# EAGLE design SisCity (EAGLE 7.7.0)
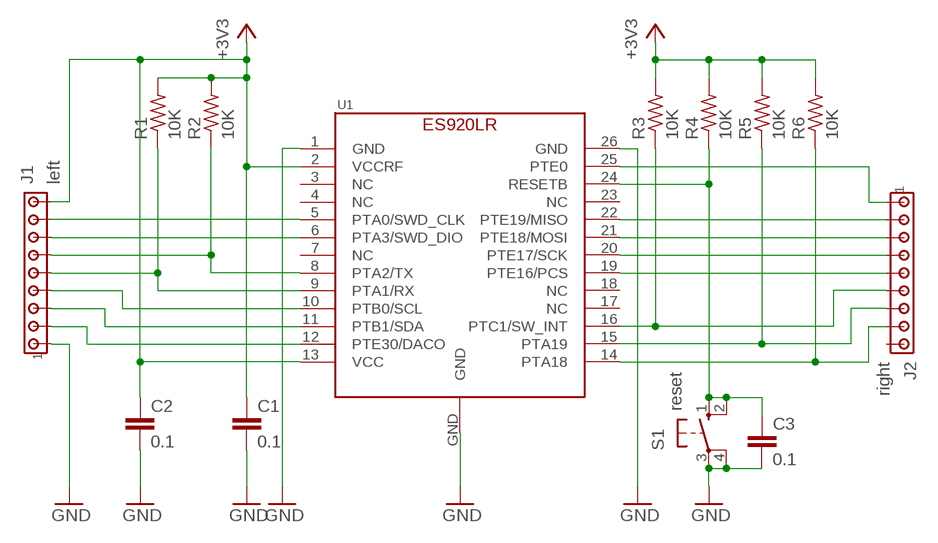
[diagram p0: schematic, sheet 1]

## Parts
C1  0.1  C  [C0805]
C2  0.1  C  [C0805]
C3  0.1  C  [C0805]
J1  left  MTA09-100  [10X09MTA]
J2  right  MTA09-100  [10X09MTA]
R1  10K  R-US_M0805  [M0805]
R2  10K  R-US_M0805  [M0805]
R3  10K  R-US_M0805  [M0805]
R4  10K  R-US_M0805  [M0805]
R5  10K  R-US_M0805  [M0805]
R6  10K  R-US_M0805  [M0805]
S1  reset  SW_10-XX  [B3F-10XX]
U1  ES920LR  [ES920LR]

## Nets
+3V3 [3V3]: C1.1 C2.1 J1.9 R1.2 R2.2 R3.2 R4.2 R5.2 R6.2 U1.2(VCCRF) U1.13(VCC)
GND [GND]: C1.2 C2.2 C3.2 J1.1 S1.3(P) S1.4(P1) U1.1(GND) U1.26(GND) U1.GND
N$1: J1.8 U1.5(PTA0/SWD_CLK)
N$2: J1.7 U1.6(PTA3/SWD_DIO)
N$3: J1.4 U1.10(PTB0/SCL)
N$4: J1.6 R2.1 U1.8(PTA2/TX)
N$5: J1.5 R1.1 U1.9(PTA1/RX)
N$6: J1.3 U1.11(PTB1/SDA)
N$7: J1.2 U1.12(PTE30/DACO)
N$8: J2.1 U1.25(PTE0)
N$9: J2.2 U1.22(PTE19/MISO)
N$10: J2.3 U1.21(PTE18/MOSI)
N$11: J2.4 U1.20(PTE17/SCK)
N$12: J2.5 U1.19(PTE16/PCS)
N$13: J2.8 R6.1 U1.14(PTA18)
N$14: J2.7 R5.1 U1.15(PTA19)
N$15: J2.6 R3.1 U1.16(PTC1/SW_INT)
N$17: C3.1 R4.1 S1.1(S) S1.2(S1) U1.24(RESETB)
Unconnected: J2.9 U1.3(NC) U1.4(NC) U1.7(NC) U1.17(NC) U1.18(NC) U1.23(NC)

## Library data of the parts
C1-C3 = 0my_lbr:C: CAPACITOR, European symbol; SPICEMODEL: NONE; SPICEPREFIX: C
J1 J2 = 0my_lbr:MTA09-100: AMP connector
R1-R6 = 0my_lbr:R-US_: RESISTOR, American symbol
S1 = 0my_lbr:SW_10-XX: OMRON SWITCH; MPN: B3F-1000; OC_FARNELL: 176432; OC_NEWARK: 36M3542
U1 = FaBo-LoRa:ES920LR

## Net classes
1 3V3: width 0.61 mm
2 GND: width 0.203 mm

## Board
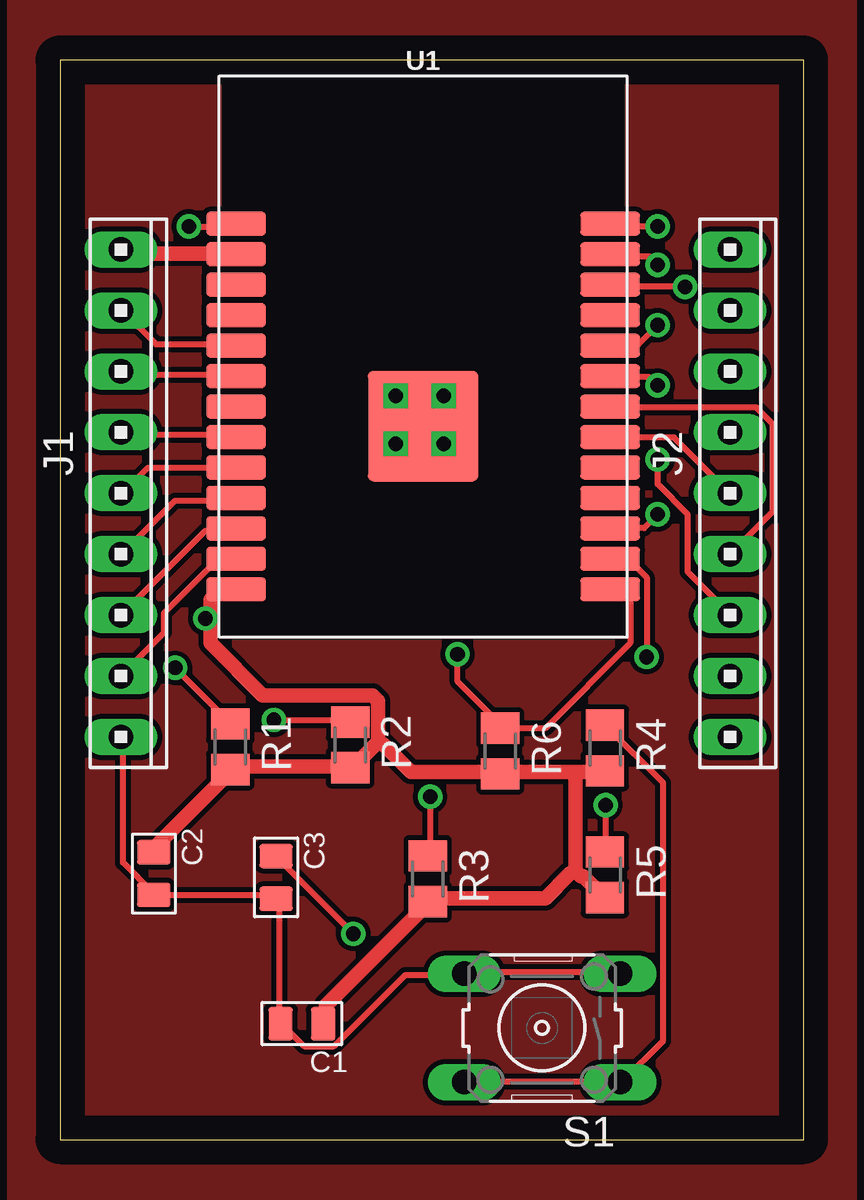
[diagram p1: board, top side]
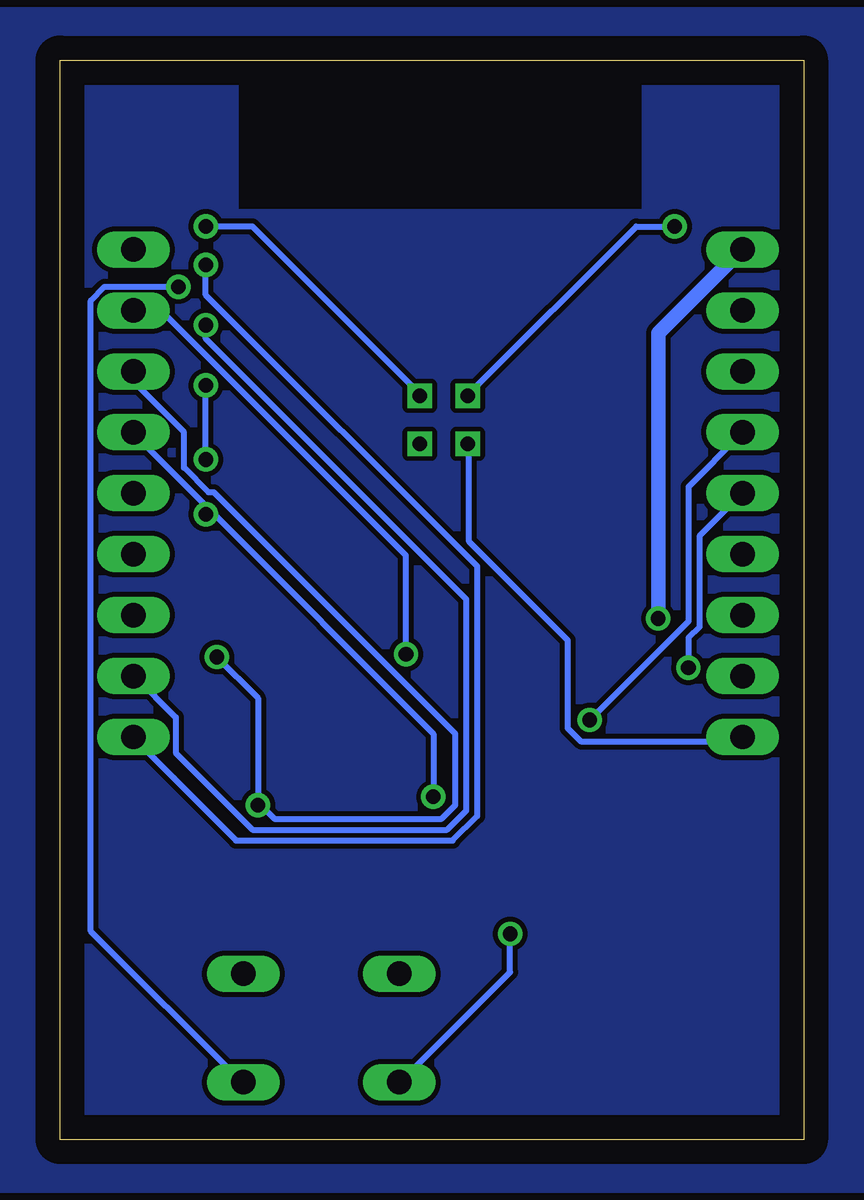
[diagram p2: board, bottom side, seen from below]

Size 31 x 45 mm. Coordinates in mm from the lower left corner, seen from the top.
Outline: 0,0 31,0 31,45 0,45 0,0
Copper layers (1*16): Top 0.035mm / dielectric 1.5mm / Bottom 0.035mm
Design rules "default *": minimum track width 10mil, minimum drill 24mil, track to track 8mil, track to pad 2mil, pad to pad 8mil, via to via 8mil, smd to smd 8mil, copper to edge 40mil, drill to drill 8mil, minimum pad ring 10mil, minimum via ring 8mil, stop-mask expansion 4mil, vias tented up to drill 0mil, thermal gap 10mil

### Footprints (pad centres in the part's own frame; a part is rotated, then mirrored left to right if it is on the bottom)
C0805 = smd 1.397 x 1.016: 1 0,0.889; 2 0,-0.889
10X09MTA = drill 1.016 long: 1 10.16,0; 2 7.62,0; 3 5.08,0; 4 2.54,0; 5 0,0; 6 -2.54,0; 7 -5.08,0; 8 -7.62,0; 9 -10.16,0
M0805 = smd 1.3 x 1.6: 1 -0.95,0; 2 0.95,0
B3F-10XX = drill 1.016 long: 1 -3.251,2.261; 2 3.251,2.261; 3 -3.251,-2.261; 4 3.251,-2.261
ES920LR = smd 2.5 x 1: 1 -7.8,5.84; 2 -7.8,4.57; 3 -7.8,3.3; 4 -7.8,2.03; 5 -7.8,0.76; 6 -7.8,-0.51; 7 -7.8,-1.78; 8 -7.8,-3.05; 9 -7.8,-4.32; 10 -7.8,-5.59; 11 -7.8,-6.86; 12 -7.8,-8.13; 13 -7.8,-9.4; 14 7.8,-9.4; 15 7.8,-8.13; 16 7.8,-6.86; 17 7.8,-5.59; 18 7.8,-4.32; 19 7.8,-3.05; 20 7.8,-1.78; 21 7.8,-0.51; 22 7.8,0.76; 23 7.8,2.03; 24 7.8,3.3; 25 7.8,4.57; 26 7.8,5.84 | smd 4.6 x 4.6: GND 0,-2.6

### Placement (x,y rotation side)
C1  10.09,4.83 270 top
C2  3.92,11.09 0 top
C3  9.01,10.93 0 top
J1  2.54,26.94 270 top
J2  27.94,26.94 270 top
R1  7.1,16.37 270 top
R2  12.1,16.45 270 top
R3  15.34,10.87 270 top
R4  22.72,16.32 270 top
R5  22.72,11.04 270 top
R6  18.36,16.2 270 top
S1  20.1,4.65 180 top
U1  15.14,32.34 0 top

### Tracks (layer width: path | path; a pad name or v marks a point on that pad's centre or on a via)
+3V3  (via drill 0.61)
  Top 0.61: C1.1 11.09,4.92 11.09,5.6 15.32,9.83 R3.2 15.54,10.06 20.23,10.06 21.26,11.09 21.49,11.2 | 21.49,15.32 22.63,15.32 R4.2 | 21.49,15.32 18.4,15.32 R6.2 18.06,15.32 14.63,15.32 13.49,16.46 13.26,16.57 | 21.49,11.2 21.72,10.97 21.83,10.97 22.63,10.17 R5.2 | 21.49,15.32 21.49,11.2 | U1.2 7.32,36.92 2.74,36.92 2.63,37.03 J1.9 | C2.1 4,12 4,12.23 7.09,15.32 R1.2 7.32,15.54 12,15.54 R2.2 12.34,15.66 13.26,16.57 | 6.29,21.72 6.29,20.69 8.46,18.52 13.03,18.52 13.26,18.29 13.26,16.57 | 6.29,21.72 6.29,22.52 6.63,22.86 7.32,22.86 U1.13 | v6.06,21.72 6.29,21.72
  Bottom 0.61: v6.06,21.72 6.06,33.6 2.63,37.03 J1.9
GND  (via drill 0.6, 0.61)
  Top 0.254: v14,29 14.06,29.03 14.4,29.03 15.09,29.72 U1.GND | 14.97,30.06 15.2,29.83 U1.GND | 14.97,30.06 14.06,30.98 v14,31 | v16,29 15.89,29.03 15.2,29.72 U1.GND | 14.97,30.06 15.89,30.98 v16,31 | 14.97,30.06 U1.GND | v5.37,38.06 7.32,38.06 U1.1 | v24.92,38.06 22.97,38.06 U1.26 | S1.3 23.32,6.97 16.92,6.97 S1.4 16.8,6.86 14.4,6.86 11.43,3.89 10.17,3.89 9.26,4.8 C1.2 9.14,4.92 9.14,10.06 C3.2 8.91,10.06 8.8,10.17 4,10.17 C2.2 3.89,10.29 2.63,11.54 2.63,16.69 J1.1
  Bottom 0.254: v5.37,38.06 6.97,38.06 13.95,31.09 v14,31 | v24.92,38.06 22.97,38.06 16,31.09 v16,31 | v14,29 13.95,28.92 13.95,24.92 9.83,20.8 9.83,17.14 9.26,16.57 2.74,16.57 2.63,16.69 J1.1
N$1
  Top 0.254: U1.5 7.32,33.15 4,33.15 2.63,34.52 J1.8
N$2
  Top 0.254: U1.6 7.32,31.89 2.74,31.89 2.63,32 J1.7
N$3
  Top 0.254: U1.10 7.32,26.63 4.8,26.63 2.63,24.46 J1.4
N$4  (via drill 0.61)
  Top 0.254: v8.91,17.49 12,17.49 R2.1 | U1.8 7.32,29.38 2.63,29.38 J1.6
  Bottom 0.254: v8.91,17.49 4.8,21.6 4.8,27.2 2.63,29.38 J1.6
N$5  (via drill 0.61)
  Top 0.254: v4.8,19.66 7.09,17.37 R1.1 | U1.9 7.32,28 3.66,28 2.63,26.98 J1.5
  Bottom 0.254: v4.8,19.66 4.8,20.92 4.34,21.37 4.34,25.15 2.63,26.86 J1.5
N$6
  Top 0.254: U1.11 7.32,25.38 6.06,25.38 2.63,21.95 J1.3
N$7
  Top 0.254: U1.12 7.32,24.12 6.51,24.12 4.34,21.95 4.34,21.14 2.63,19.43 J1.2
N$8  (via drill 0.61)
  Top 0.254: v24.92,36.46 24.57,36.8 22.97,36.8 U1.25
  Bottom 0.254: v24.92,36.46 24.92,35.2 13.6,23.89 13.6,13.49 14.63,12.46 23.66,12.46 27.89,16.69 J2.1
N$9  (via drill 0.61)
  Top 0.254: v24.92,33.95 24.12,33.15 22.97,33.15 U1.22
  Bottom 0.254: v24.92,33.95 24.92,33.38 14.06,22.52 14.06,13.72 14.86,12.92 22.97,12.92 26.18,16.12 26.18,17.6 27.89,19.32 J2.2
N$10  (via drill 0.61)
  Top 0.254: v24.92,31.43 24.57,31.77 22.97,31.77 U1.21 | v24.92,28.35 24.92,27.32 26.18,26.06 26.18,23.66 27.89,21.95 J2.3
  Bottom 0.254: v24.92,28.35 v24.92,31.43
N$11
  Top 0.254: U1.20 22.97,30.52 29.03,30.52 29.72,29.83 29.72,26.18 28,24.46 J2.4
N$12
  Top 0.254: U1.19 22.97,29.26 25.6,29.26 27.89,26.98 J2.5
N$13  (via drill 0.61)
  Top 0.254: U1.14 22.97,22.86 23.32,22.86 23.77,22.4 23.77,20.69 20.23,17.14 R6.1 18.4,17.26 16.57,19.09 v16.57,20.23
  Bottom 0.254: v16.57,20.23 16.57,24.35 26.75,34.52 27.89,34.52 J2.8
N$14  (via drill 0.61)
  Top 0.254: v22.75,13.95 22.75,12 R5.1 | v24.46,20.12 24.46,23.43 23.77,24.12 22.97,24.12 U1.15
  Bottom 0.254: v24.46,20.12 22.75,18.4 v22.75,13.95 22.63,13.95 22.06,13.37 15.09,13.37 14.52,13.95 14.52,16.92 24.57,26.98 24.8,26.98 25.83,28 25.83,29.49 27.89,31.55 27.89,32 J2.7
N$15  (via drill 0.61)
  Top 0.254: v15.43,14.29 15.43,11.89 R3.1 | v24.92,26.06 24.35,25.49 22.97,25.49 U1.16
  Bottom 0.254: v15.43,14.29 15.43,16.92 24.75,26.23 | 24.75,26.23 27.89,29.38 J2.6 | 24.75,26.23 v24.92,26.06
N$17  (via drill 0.61)
  Top 0.254: v12.23,8.57 9.03,11.77 C3.1 | R4.1 22.75,17.26 25.15,14.86 25.15,4.12 23.43,2.4 S1.1 23.32,2.4 16.92,2.4 S1.2 | v26.06,35.55 22.97,35.55 U1.24
  Bottom 0.254: v12.23,8.57 12.23,6.97 16.8,2.4 S1.2 | v26.06,35.55 29.15,35.55 29.72,34.98 29.72,8.69 23.43,2.4 S1.1
S$1
  pour Top: -2,49 33,49 33,-4 -2,-4
S$2
  pour Bottom: -4,47 35,47 35,-2 -4,-2